# EAGLE schematic cnc_driver (EAGLE 7.6.0)
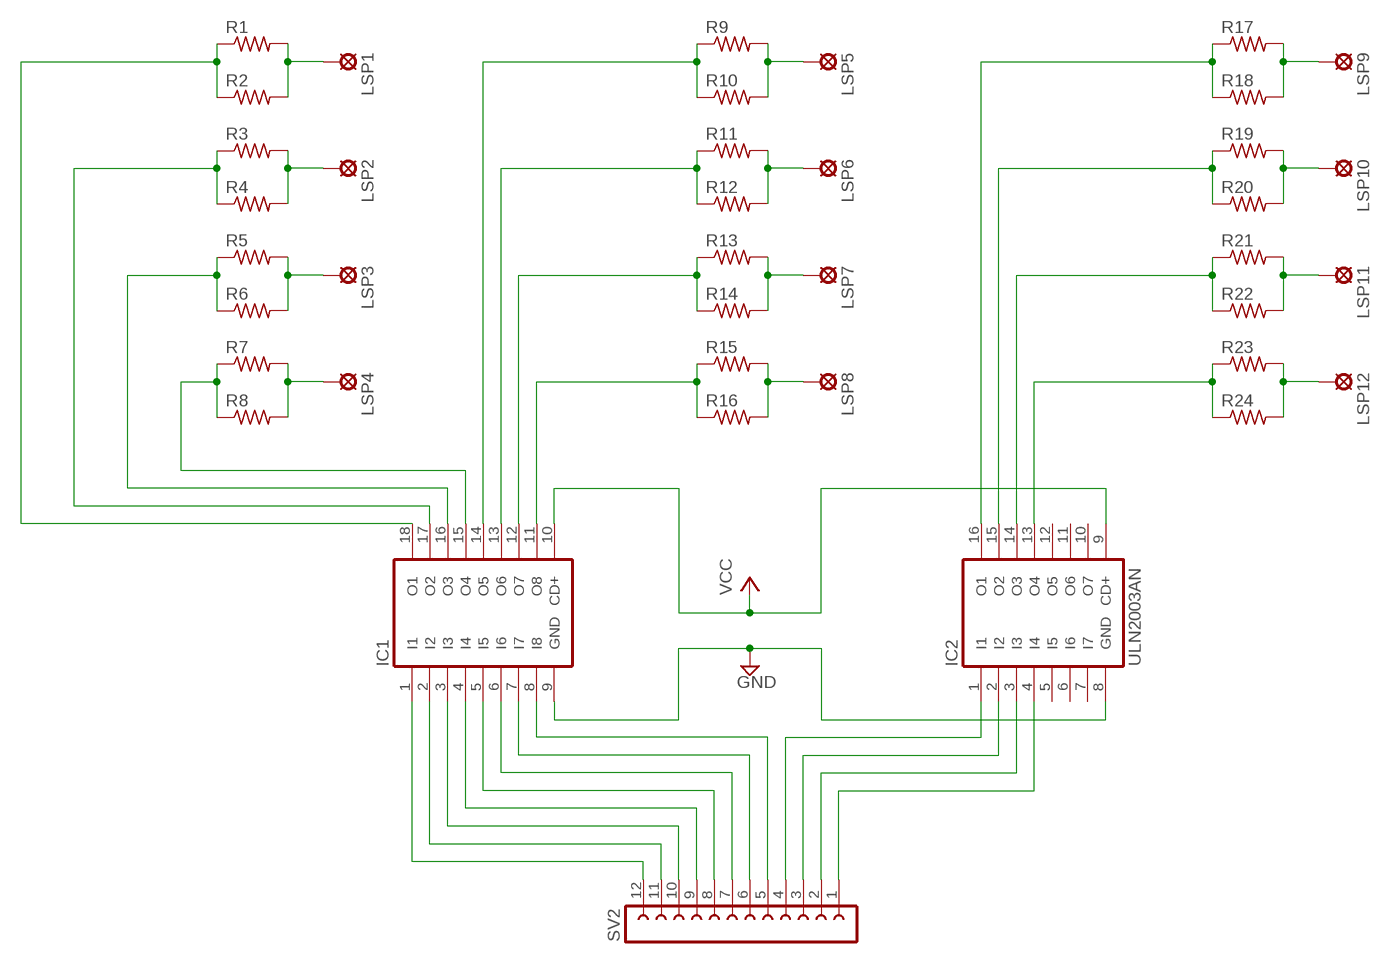
[diagram p0: schematic, sheet 1]

## Parts
IC1  ULN2803A  [DIL18]
IC2  ULN2003AN  [DIL16]
LSP1  LSP11  [LSP11]
LSP2  LSP11  [LSP11]
LSP3  LSP11  [LSP11]
LSP4  LSP11  [LSP11]
LSP5  LSP11  [LSP11]
LSP6  LSP11  [LSP11]
LSP7  LSP11  [LSP11]
LSP8  LSP11  [LSP11]
LSP9  LSP11  [LSP11]
LSP10  LSP11  [LSP11]
LSP11  LSP11  [LSP11]
LSP12  LSP11  [LSP11]
R1  R-US_0922V  [0922V]
R2  R-US_0922V  [0922V]
R3  R-US_0922V  [0922V]
R4  R-US_0922V  [0922V]
R5  R-US_0922V  [0922V]
R6  R-US_0922V  [0922V]
R7  R-US_0922V  [0922V]
R8  R-US_0922V  [0922V]
R9  R-US_0922V  [0922V]
R10  R-US_0922V  [0922V]
R11  R-US_0922V  [0922V]
R12  R-US_0922V  [0922V]
R13  R-US_0922V  [0922V]
R14  R-US_0922V  [0922V]
R15  R-US_0922V  [0922V]
R16  R-US_0922V  [0922V]
R17  R-US_0922V  [0922V]
R18  R-US_0922V  [0922V]
R19  R-US_0922V  [0922V]
R20  R-US_0922V  [0922V]
R21  R-US_0922V  [0922V]
R22  R-US_0922V  [0922V]
R23  R-US_0922V  [0922V]
R24  R-US_0922V  [0922V]
SV2  FE12-1  [FE12]

## Nets
GND: IC1.9(GND) IC2.8(GND)
N$1: IC1.18(O1) R1.1 R2.1
N$2: IC1.17(O2) R3.1 R4.1
N$3: IC1.16(O3) R5.1 R6.1
N$4: IC1.15(O4) R7.1 R8.1
N$5: LSP1.MP R1.2 R2.2
N$6: LSP2.MP R3.2 R4.2
N$7: LSP3.MP R5.2 R6.2
N$8: LSP4.MP R7.2 R8.2
N$9: LSP5.MP R9.2 R10.2
N$10: LSP6.MP R11.2 R12.2
N$11: LSP7.MP R13.2 R14.2
N$12: LSP8.MP R15.2 R16.2
N$13: IC1.14(O5) R9.1 R10.1
N$14: IC1.13(O6) R11.1 R12.1
N$15: IC1.12(O7) R13.1 R14.1
N$16: IC1.11(O8) R15.1 R16.1
N$17: IC2.16(O1) R17.1 R18.1
N$18: IC2.15(O2) R19.1 R20.1
N$19: IC2.14(O3) R21.1 R22.1
N$20: IC2.13(O4) R23.1 R24.1
N$21: LSP9.MP R17.2 R18.2
N$22: LSP10.MP R19.2 R20.2
N$23: LSP11.MP R21.2 R22.2
N$24: LSP12.MP R23.2 R24.2
N$25: IC1.1(I1) SV2.12
N$26: IC1.2(I2) SV2.11
N$27: IC1.3(I3) SV2.10
N$28: IC1.4(I4) SV2.9
N$29: IC1.5(I5) SV2.8
N$30: IC1.6(I6) SV2.7
N$31: IC1.7(I7) SV2.6
N$32: IC1.8(I8) SV2.5
N$33: IC2.1(I1) SV2.4
N$34: IC2.2(I2) SV2.3
N$35: IC2.3(I3) SV2.2
N$36: IC2.4(I4) SV2.1
VCC: IC1.10(CD+) IC2.9(CD+)
Unconnected: IC2.5(I5) IC2.6(I6) IC2.7(I7) IC2.10(O7) IC2.11(O6) IC2.12(O5)

## Library data of the parts
IC1 = uln-udn:ULN2803A: DRIVER ARRAY
IC2 = uln-udn:ULN2003A: DRIVER ARRAY
LSP1-LSP12 = solpad:LSP11: SOLDER PAD drill 1.1 mm
R1-R24 = resistor:R-US_: RESISTOR, American symbol
SV2 = con-lsta:FE12-1: FEMALE HEADER; OC_FARNELL: unknown; OC_NEWARK: unknown